# Altium schematic sheet Power.SchDoc
size A4; SheetNumber: 4; SheetTotal: 4
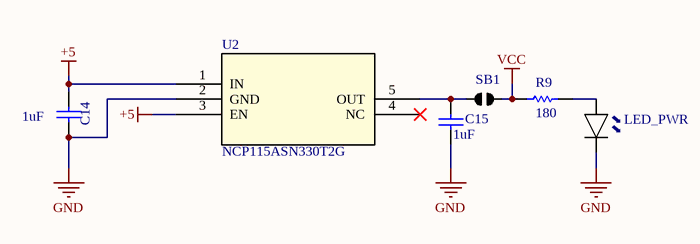
[diagram p0: Power.SchDoc]

## Parts
C14  value 1uF  [J1-0603]  (hidden comment: C15849)
C15  value 1uF  [J1-0603]  (hidden comment: C15849)
LED_PWR  C2286  [LEDC1608X70N]  (value not drawn)
R9  value 180  [J1-0603]  (hidden comment: C22828)
SB1  Solder Bridge  [Solder Bridge]  (value not drawn)
U2  NCP115ASN330T2G  [SOT95P275X120-5N]

## Nets
+5: C14.2 U2.1(IN) U2.3(EN)
GND: C14.1 C15.1 LED_PWR.1 U2.2(GND)
VCC: R9.1 SB1.2
NetC15_2: C15.2 SB1.1 U2.5(OUT)
NetLED_PWR_2: LED_PWR.2 R9.2

Not connected (* = marked no-connect by the designer): U2 4(NC)*

## Notes on the sheet
- (in symbol fucking led maat hoe moeilijk ist kutprogram) ⬈⬈

## Library data of the parts
C14 C15 = Cap: Capacitor; Published: 8-Jun-2000; LatestRevisionDate: 17-Jul-2002; LatestRevisionNote: Re-released for DXP Platform.; PackageReference: RAD-0.3; Publisher: Altium Limited; PackageDescription: Radial Cap, Thru-Hole; 2 Leads; 0.3 in Pin Spacing
LED_PWR = fucking led maat hoe moeilijk ist kutprogram
R9 = Res1: Published: 8-Jun-2000; LatestRevisionDate: 17-Jul-2002; LatestRevisionNote: Re-released for DXP Platform.; PackageReference: AXIAL-0.3; Publisher: Altium Limited; PackageDescription: Axial Device, Thru-Hole; 2 Leads; 0.3 in Pin Spacing
SB1 = Solder Bridge: DNP
U2 = NCP115ASN330T2G: C603505; Mfr_Name: onsemi; Copyright: Copyright (C) 2023 Ultra Librarian. All rights reserved.; Manufacturer_Part_Number: NCP115ASN330T2G; RefDes: RefDes; Type: DEV